# EAGLE design driverCorriente (EAGLE 6.5.0)
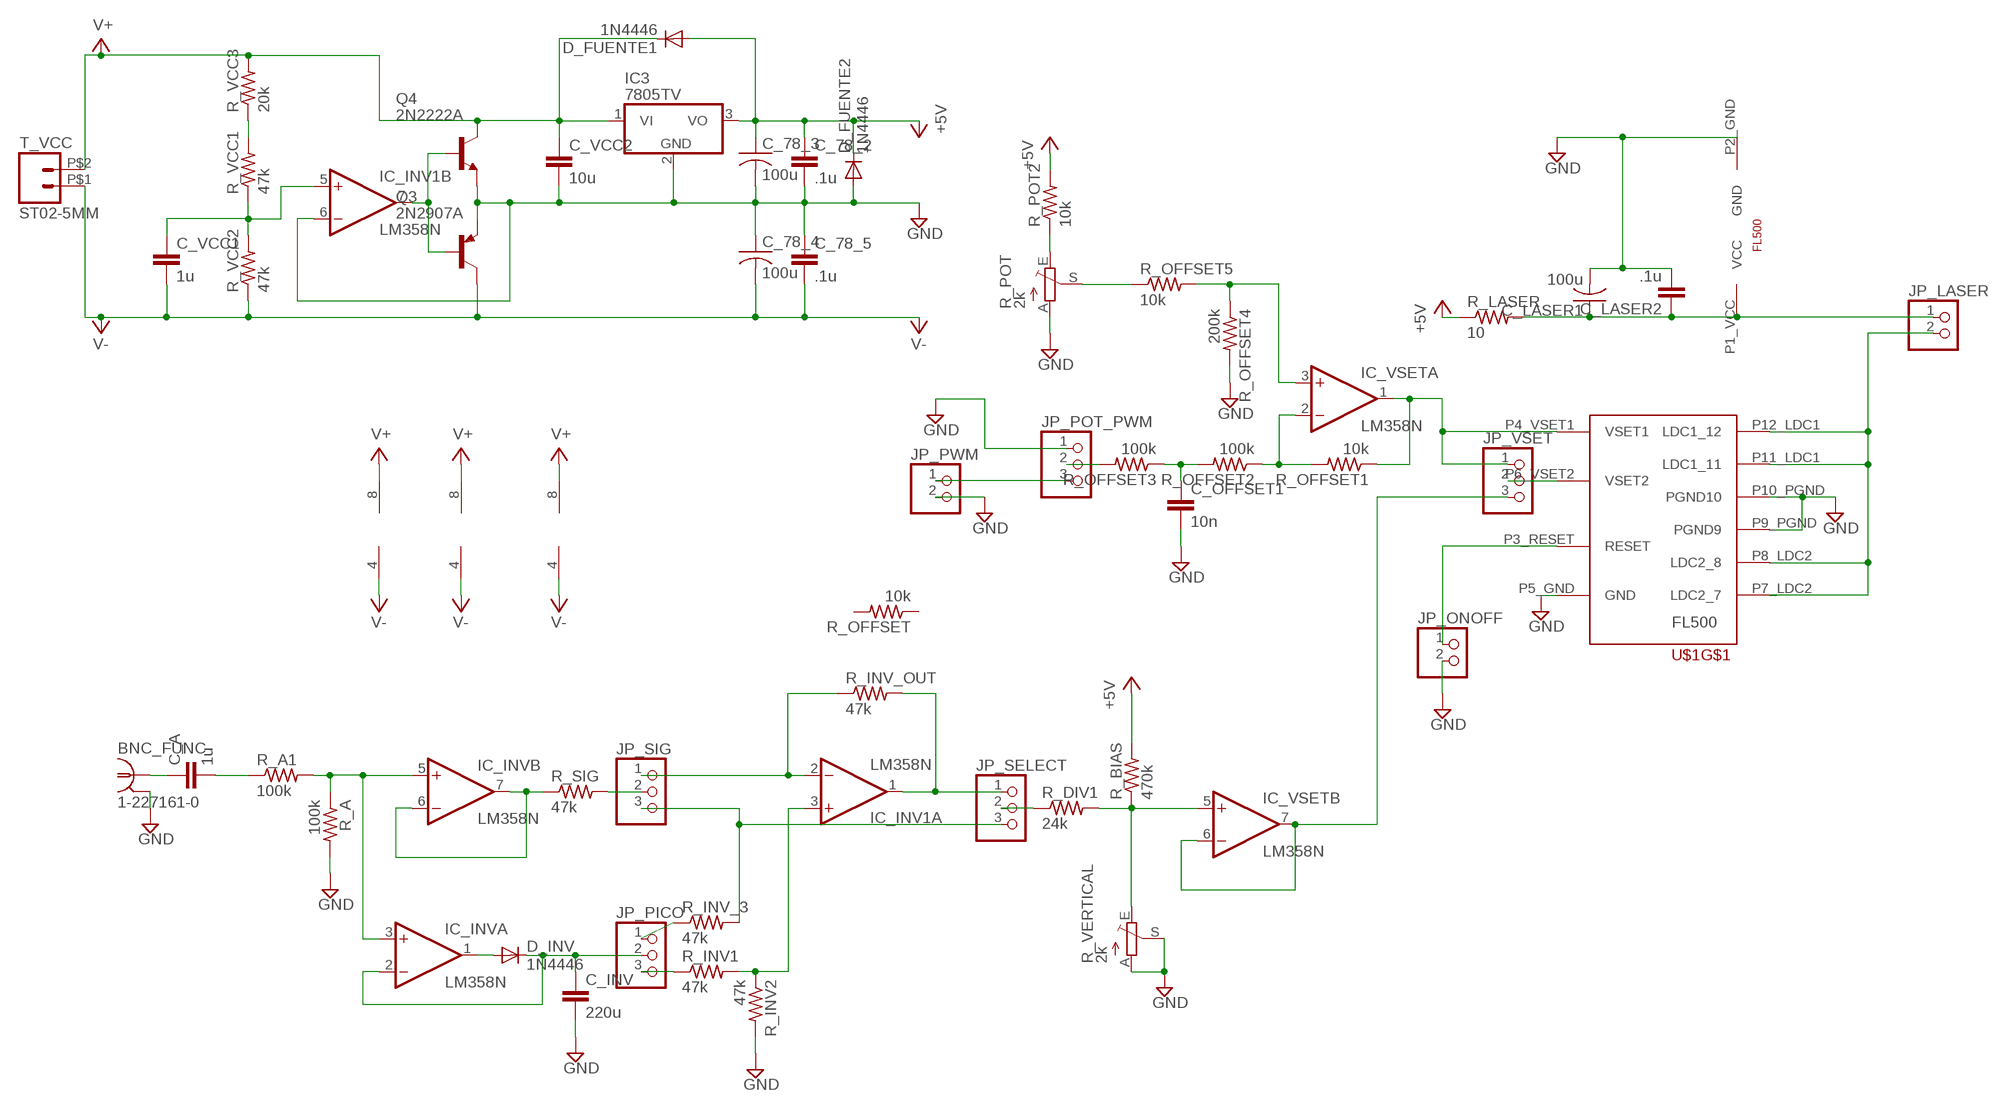
[diagram p0: schematic, sheet 1]

## Parts
BNC_FUNC  1-227161-0  [AMP_227161]
C_78_2  .1u  C-EU050-045X075  [C050-045X075]
C_78_3  100u  C-US050-075X075  [C050-075X075]
C_78_4  100u  C-US050-075X075  [C050-075X075]
C_78_5  .1u  C-EU050-045X075  [C050-045X075]
C_A  1u  C-EU050-045X075  [C050-045X075]
C_INV  220u  C-EU050-045X075  [C050-045X075]
C_LASER1  100u  C-US050-075X075  [C050-075X075]
C_LASER2  .1u  C-EU050-045X075  [C050-045X075]
C_OFFSET1  10n  C-EU050-045X075  [C050-045X075]
C_VCC1  1u  C-EU050-045X075  [C050-045X075]
C_VCC2  10u  C-EU050-045X075  [C050-045X075]
D_FUENTE1  1N4446  [DO35-10]
D_FUENTE2  1N4446  [DO35-10]
D_INV  1N4446  [DO35-10]
IC3  7805TV  [TO220V]
IC_INV  LM358N  [DIL08]
IC_INV1  LM358N  [DIL08]
IC_VSET  LM358N  [DIL08]
JP_LASER  PINHD-1X2  [1X02]
JP_ONOFF  PINHD-1X2  [1X02]
JP_PICO  PINHD-1X3  [1X03]
JP_POT_PWM  PINHD-1X3  [1X03]
JP_PWM  PINHD-1X2  [1X02]
JP_SELECT  PINHD-1X3  [1X03]
JP_SIG  PINHD-1X3  [1X03]
JP_VSET  PINHD-1X3  [1X03]
Q3  2N2907A  [TO18]
Q4  2N2222A  [TO18]
R_A  100k  R-US_0207/12  [0207/12]
R_A1  100k  R-US_0207/12  [0207/12]
R_BIAS  470k  R-US_0207/12  [0207/12]
R_DIV1  24k  R-US_0207/12  [0207/12]
R_INV1  47k  R-US_0207/12  [0207/12]
R_INV2  47k  R-US_0207/12  [0207/12]
R_INV_3  47k  R-US_0207/12  [0207/12]
R_INV_OUT  47k  R-US_0207/12  [0207/12]
R_LASER  10  R-US_0207/12  [0207/12]
R_OFFSET  10k  R-US_0207/12  [0207/12]
R_OFFSET1  10k  R-US_0207/12  [0207/12]
R_OFFSET2  100k  R-US_0207/12  [0207/12]
R_OFFSET3  100k  R-US_0207/12  [0207/12]
R_OFFSET4  200k  R-US_0207/12  [0207/12]
R_OFFSET5  10k  R-US_0207/12  [0207/12]
R_POT  2k  TRIM_EU-B64Y  [B64Y]
R_POT2  10k  R-US_0207/12  [0207/12]
R_SIG  47k  R-US_0207/12  [0207/12]
R_VCC1  47k  R-US_0207/12  [0207/12]
R_VCC2  47k  R-US_0207/12  [0207/12]
R_VCC3  20k  R-US_0207/12  [0207/12]
R_VERTICAL  2k  TRIM_EU-B64Y  [B64Y]
T_VCC  ST02-5MM  [EK500V-02P]
U$1  FL500  [FL500]

## Nets
+5V: C_78_2.1 C_78_3.1 D_FUENTE1.A D_FUENTE2.C IC3.3(VO) R_BIAS.2 R_LASER.1 R_POT2.2
GND: BNC_FUNC.2 C_78_2.2 C_78_3.2 C_78_4.1 C_78_5.1 C_INV.2 C_LASER1.2 C_LASER2.2 C_OFFSET1.2 C_VCC2.2 D_FUENTE2.A IC3.2(GND) IC_INV1.6(B:-IN) JP_ONOFF.2 JP_POT_PWM.1 JP_PWM.2 Q3.1(E) Q4.1(E) R_A.2 R_INV2.2 R_OFFSET4.2 R_POT.A R_VERTICAL.A R_VERTICAL.S U$1.P2_GND(GND) U$1.P5_GND(GND) U$1.P9_PGND(PGND9) U$1.P10_PGND(PGND10)
N$1: JP_LASER.2 U$1.P7_LDC2(LDC2_7) U$1.P8_LDC2(LDC2_8) U$1.P11_LDC1(LDC1_11) U$1.P12_LDC1(LDC1_12)
N$2: R_POT2.1 R_POT.E
N$4: IC_VSET.1(A:OUT) JP_VSET.1 R_OFFSET1.1 U$1.P4_VSET1(VSET1)
N$6: JP_ONOFF.1 U$1.P3_RESET(RESET)
N$7: IC_INV.3(A:+IN) IC_INV.5(B:+IN) R_A1.2 R_A.1
N$8: D_INV.A IC_INV.1(A:OUT)
N$9: C_INV.1 D_INV.C IC_INV.2(A:-IN) JP_PICO.2
N$10: JP_PICO.1 R_INV_3.1
N$11: JP_SIG.2 R_SIG.2
N$12: JP_SELECT.3 JP_SIG.3 R_INV_3.2
N$13: JP_PICO.3 R_INV1.1
N$14: IC_INV1.3(A:+IN) R_INV1.2 R_INV2.1
N$15: IC_INV1.2(A:-IN) JP_SIG.1 R_INV_OUT.1
N$16: IC_INV1.1(A:OUT) JP_SELECT.1 R_INV_OUT.2
N$17: JP_SELECT.2 R_DIV1.1
N$18: IC_VSET.5(B:+IN) R_BIAS.1 R_DIV1.2 R_VERTICAL.E
N$19: IC_VSET.6(B:-IN) IC_VSET.7(B:OUT) JP_VSET.3
N$20: BNC_FUNC.1 C_A.1
N$21: JP_POT_PWM.2 R_OFFSET3.2
N$23: JP_POT_PWM.3 JP_PWM.1
N$24: JP_VSET.2 U$1.P6_VSET2(VSET2)
N$25: IC_INV.6(B:-IN) IC_INV.7(B:OUT) R_SIG.1
N$26: C_A.2 R_A1.1
N$27: C_VCC1.1 IC_INV1.5(B:+IN) R_VCC1.1 R_VCC2.2
N$29: R_VCC1.2 R_VCC3.1
N$30: IC_INV1.7(B:OUT) Q3.2(B) Q4.2(B)
N$34: R_OFFSET5.1 R_POT.S
N$35: IC_VSET.2(A:-IN) R_OFFSET1.2 R_OFFSET2.1
N$36: C_OFFSET1.1 R_OFFSET2.2 R_OFFSET3.1
N$37: IC_VSET.3(A:+IN) R_OFFSET4.1 R_OFFSET5.2
V+: C_VCC2.1 D_FUENTE1.C IC3.1(VI) IC_INV1.8(P:V+) IC_INV.8(P:V+) IC_VSET.8(P:V+) Q4.3(C) R_VCC3.2 T_VCC.P$2
V-: C_78_4.2 C_78_5.2 C_VCC1.2 IC_INV1.4(P:V-) IC_INV.4(P:V-) IC_VSET.4(P:V-) Q3.3(C) R_VCC2.1 T_VCC.P$1
VCC_LASER: C_LASER1.1 C_LASER2.1 JP_LASER.1 R_LASER.2 U$1.P1_VCC(VCC)
Unconnected: R_OFFSET.1 R_OFFSET.2

## Library data of the parts
BNC_FUNC = con-coax:?227161*: JACK, RIGHT ANGLE, 50 OHM, PCB, BNC Source: amp_227161.pdf; MF: TYCO ELECTRONICS; MPN: 1-227161; OC_FARNELL: unknown; OC_NEWARK: 33B3200
C_78_2 C_78_5 C_A C_INV C_LASER2 C_OFFSET1 C_VCC1 C_VCC2 = rcl:C-EU: CAPACITOR, European symbol
C_78_3 C_78_4 C_LASER1 = rcl:C-US: CAPACITOR, American symbol
D_FUENTE1 D_FUENTE2 D_INV = diode:1N4446: DIODE high speed (Philips)
IC3 = linear:78*: Positive VOLTAGE REGULATOR Source: http://cache.national.com/ds/LM/LM78L05.pdf http://www.fairchildsemi.com/ds/LM/LM7805.pdf
IC_INV IC_INV1 IC_VSET = linear:LM358: OP AMP also LM158; LM258; LM2904 Source: http://cache.national.com/ds/LM/LM158.pdf
JP_LASER JP_ONOFF JP_PWM = pinhead:PINHD-1X2: PIN HEADER
JP_PICO JP_POT_PWM JP_SELECT JP_SIG JP_VSET = pinhead:PINHD-1X3: PIN HEADER
Q3 = transistor-pnp:2N2907*: PNP Transistor
Q4 = transistor-npn:2N2222*: NPN Transistor
R_A R_A1 R_BIAS R_DIV1 R_INV1 R_INV2 R_INV_3 R_INV_OUT R_LASER R_OFFSET R_OFFSET1-R_OFFSET5 R_POT2 R_SIG R_VCC1-R_VCC3 = rcl:R-US_: RESISTOR, American symbol
R_POT R_VERTICAL = pot:TRIM_EU-: POTENTIOMETER
T_VCC = con-dinkle:ST02: Dinkle® Screw Terminal Block - 2 Way -5MM: EK500V series. Rated at 20A, 300VAC. Cable size: 2mm² Supplier: Altronics P2034A Source: http://www.dinkle.com/upfiles/proter21253708953.pdf -5.08MM: The back half of a EK500V4R-04P. Rated at 20A, 300VAC. Cable size: 2mm² Supplier: Altronics P2024 (half of) Source: http://www.dinkle.com/upfiles/proter21253708833.pdf -3.5MM: ED350V series. Rated at 10A, 300VAC. Cable size: 1.4mm² Supplier: Altronics P2028 Source: http://www.dinkle.com/upfiles/proter21253714491.pdf
U$1 = 00_Lolo:FL500: FL500 diode laser current driver http://www.teamwavelength.com/products/product.php?part=147&view=tools#tabs

## Board
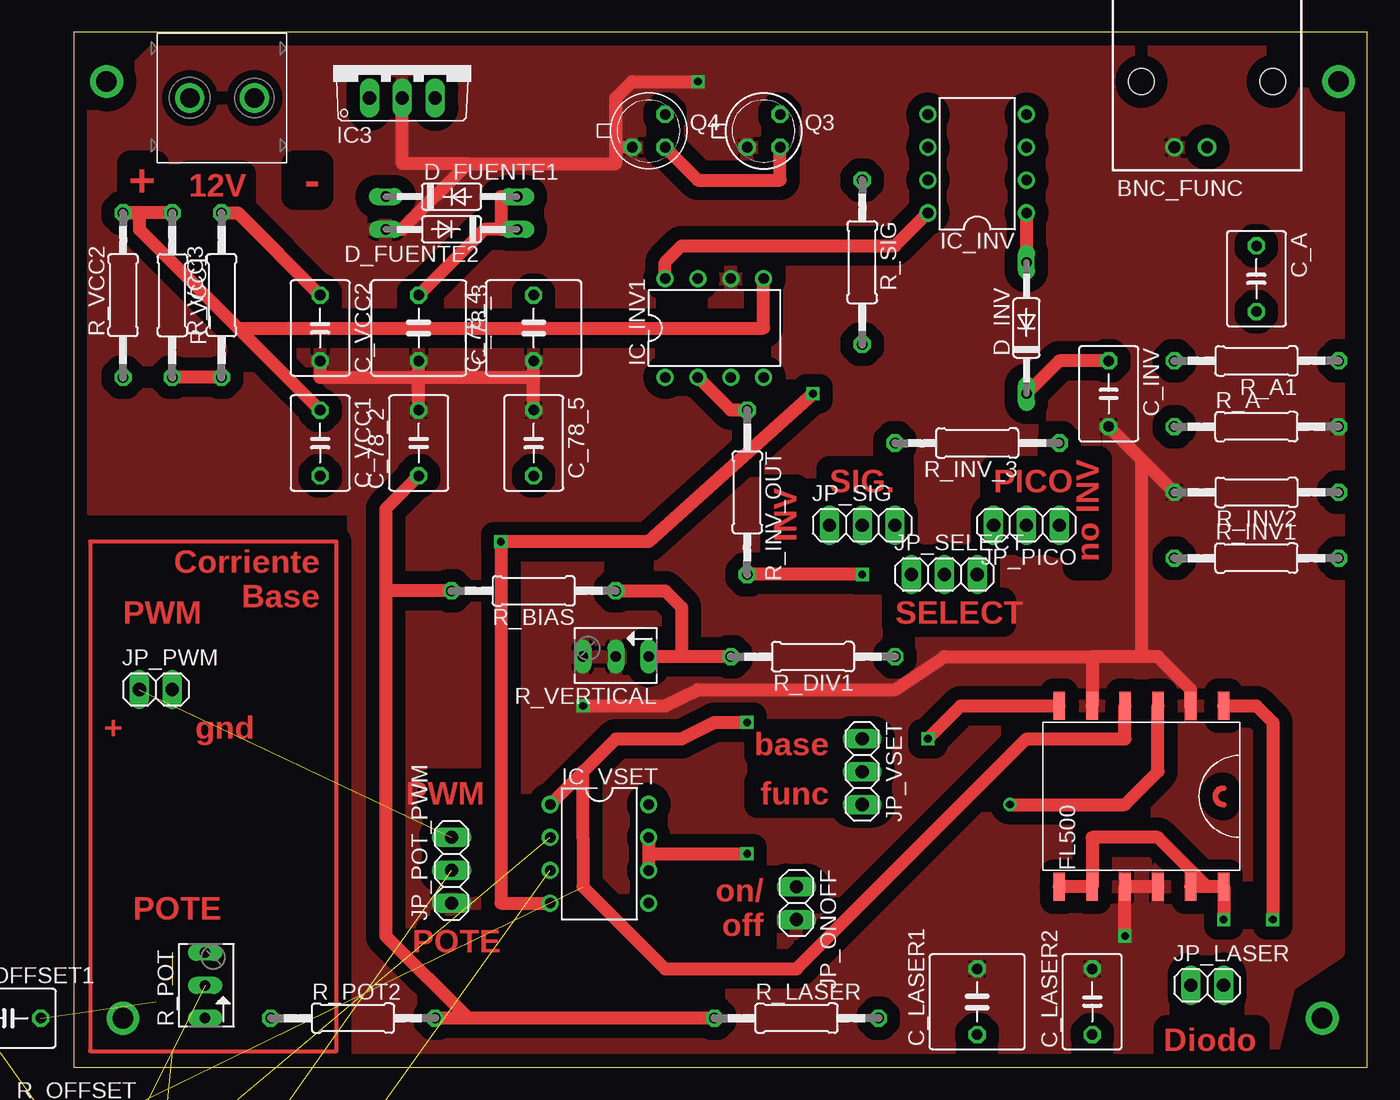
[diagram p1: board, top side]
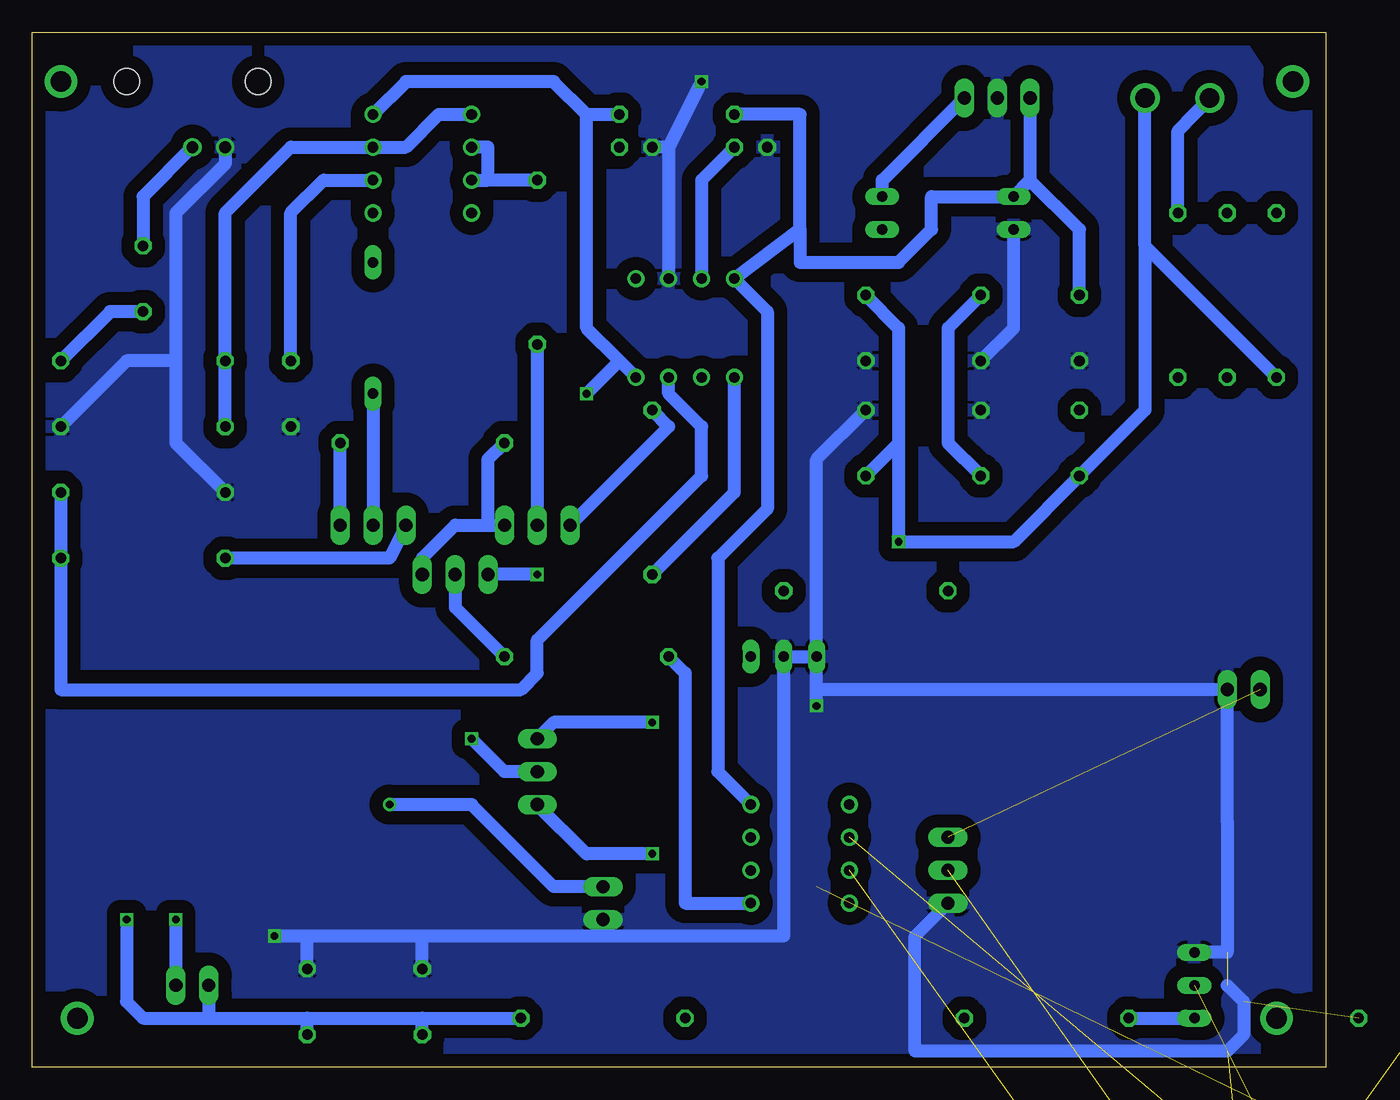
[diagram p2: board, bottom side, seen from below]

Size 100 x 80 mm. Coordinates in mm from the lower left corner, seen from the top.
Outline: 0,0 100,0 100,80 0,80 0,0
Copper layers (1*16): Top 0.035mm / dielectric 1.5mm / Bottom 0.035mm
Design rules "driverPZT_01 *": minimum track width 40mil, minimum drill 24mil, track to track 40mil, track to pad 40mil, pad to pad 40mil, via to via 40mil, smd to smd 40mil, copper to edge 40mil, drill to drill 8mil, minimum pad ring 10mil, minimum via ring 8mil, stop-mask expansion 4mil, vias tented up to drill 0mil, thermal gap 10mil

### Footprints (pad centres in the part's own frame; a part is rotated, then mirrored left to right if it is on the bottom)
AMP_227161 = drill 0.9 pad 1.27: 1 0,-5.08; 2 -2.54,-5.08 | hole 2: -5.08,0; 5.08,0
C050-045X075 = drill 0.813 octagon: 1 -2.54,0; 2 2.54,0
C050-075X075 = drill 0.813 octagon: 1 -2.54,0; 2 2.54,0
DO35-10 = drill 0.813 long: A 5.08,0; C -5.08,0
TO220V = drill 1.016 long: 1 -2.54,-2.54; 2 0,-2.54; 3 2.54,-2.54
DIL08 = drill 0.813 pad 1.27: 1 -3.81,-3.81; 2 -1.27,-3.81; 3 1.27,-3.81; 4 3.81,-3.81; 5 3.81,3.81; 6 1.27,3.81; 7 -1.27,3.81; 8 -3.81,3.81
1X02 = drill 1.016 long: 1 -1.27,0; 2 1.27,0
1X03 = drill 1.016 long: 1 -2.54,0; 2 0,0; 3 2.54,0
TO18 = drill 0.813 octagon: 1 -1.27,-1.27; 2 1.27,-1.27; 3 1.27,1.27
0207/12 = drill 0.813 octagon: 1 -6.35,0; 2 6.35,0
B64Y = drill 0.813 long: A 2.54,0; E -2.54,0; S 0,0
EK500V-02P = drill 1.5: P$1 0,0; P$2 5,0
FL500 = smd 2.159 x 0.889: P1_VCC -6.35,6.35; P2_GND -6.35,3.81; P3_RESET -6.35,1.27; P4_VSET1 -6.35,-1.27; P5_GND -6.35,-3.81; P6_VSET2 -6.35,-6.35; P7_LDC2 7.62,-6.35; P8_LDC2 7.62,-3.81; P9_PGND 7.62,-1.27; P10_PGND 7.62,1.27; P11_LDC1 7.62,3.81; P12_LDC1 7.62,6.35

### Placement (x,y rotation side)
BNC_FUNC  87.63,76.2 0 top
C_78_2  26.67,48.26 90 top
C_78_3  26.67,57.15 270 top
C_78_4  35.56,57.15 90 top
C_78_5  35.56,48.26 270 top
C_A  91.44,60.96 270 top
C_INV  80.01,52.07 270 top
C_LASER1  69.85,5.08 90 top
C_LASER2  78.74,5.08 90 top
C_OFFSET1  -5.08,3.81 0 top
C_VCC1  19.05,48.26 270 top
C_VCC2  19.05,57.15 270 top
D_FUENTE1  29.21,67.31 0 top
D_FUENTE2  29.21,64.77 180 top
D_INV  73.66,57.15 90 top
IC3  25.4,77.47 0 top
IC_INV  69.85,69.85 90 top
IC_INV1  49.53,57.15 0 top
IC_VSET  40.64,16.51 270 top
JP_LASER  87.63,6.35 0 top
JP_ONOFF  55.88,12.7 270 top
JP_PICO  73.66,41.91 180 top
JP_POT_PWM  29.21,15.24 90 top
JP_PWM  6.35,29.21 0 top
JP_SELECT  67.31,38.1 0 top
JP_SIG  60.96,41.91 0 top
JP_VSET  60.96,22.86 270 top
Q3  53.34,72.39 0 top
Q4  44.45,72.39 0 top
R_A  91.44,49.53 0 top
R_A1  91.44,54.61 180 top
R_BIAS  35.56,36.83 180 top
R_DIV1  57.15,31.75 180 top
R_INV1  91.44,39.37 0 top
R_INV2  91.44,44.45 180 top
R_INV_3  69.85,48.26 180 top
R_INV_OUT  52.07,44.45 270 top
R_LASER  55.88,3.81 0 top
R_OFFSET  -1.27,-3.81 0 top  (outside the outline)
R_OFFSET1  -1.27,-8.89 0 top  (outside the outline)
R_OFFSET2  -1.27,-13.97 0 top  (outside the outline)
R_OFFSET3  -1.27,-19.05 0 top  (outside the outline)
R_OFFSET4  -1.27,-24.13 0 top  (outside the outline)
R_OFFSET5  -1.27,-29.21 0 top  (outside the outline)
R_POT  10.16,6.35 90 top
R_POT2  21.59,3.81 0 top
R_SIG  60.96,62.23 270 top
R_VCC1  7.62,59.69 270 top
R_VCC2  3.81,59.69 90 top
R_VCC3  11.43,59.69 90 top
R_VERTICAL  41.91,31.75 180 top
T_VCC  13.97,74.93 180 top
U$1  82.55,21.59 270 top

### Tracks (layer width: path | path; a pad name or v marks a point on that pad's centre or on a via)
+5V
  Top 1.016: R_LASER.1 R_POT2.2 30.48,3.81 24.13,10.16 24.13,36.83 | D_FUENTE1.A 33.02,67.31 33.02,64.77 D_FUENTE2.C 31.75,64.77 C_78_3.1 | C_78_2.1 24.13,43.18 24.13,36.83 | R_BIAS.2 24.13,36.83
  Bottom 1.016: C_78_2.1 29.21,48.26 29.21,57.15 C_78_3.1 | IC3.3 34.29,68.58 D_FUENTE1.A
GND  (via drill 0.6)  (3 unrouted)
  Top 1.016: 78.74,31.75 U$1.P5_GND | 82.55,31.75 83.82,31.75 86.36,29.21 U$1.P2_GND | 82.55,31.75 78.74,31.75 | C_INV.2 82.55,46.99 | 82.55,46.99 R_INV2.2 | 82.55,46.99 82.55,31.75 | 41.91,71.12 41.91,69.85 30.48,69.85 | 30.48,69.85 25.4,64.77 D_FUENTE2.A | IC3.2 25.4,69.85 30.48,69.85 | U$1.P10_PGND U$1.P9_PGND v81.28,10.16 | 78.74,31.75 67.31,31.75 63.5,29.21 48.26,29.21 45.72,27.94 v39.37,27.94 | Q4.1 41.91,71.12 | 41.91,71.12 41.91,74.93 43.18,76.2 v48.26,76.2 | C_VCC2.2 19.05,53.34 26.67,53.34 | 26.67,53.34 C_78_3.2 | C_78_2.2 26.67,53.34 | 26.67,53.34 35.56,53.34 | C_78_5.1 35.56,53.34 | 35.56,53.34 C_78_4.1
  Bottom 1.016: 50.8,71.12 IC_INV1.6 | D_FUENTE2.A 24.13,57.15 C_78_3.2 | R_POT.A 7.62,8.89 7.62,19.05 JP_PWM.2 39.37,29.21 | 55.88,10.16 41.91,10.16 R_VERTICAL.S R_VERTICAL.A | C_78_5.1 39.37,46.99 R_VERTICAL.A | v48.26,76.2 50.8,71.12 | 50.8,71.12 Q3.1 | 55.88,10.16 JP_ONOFF.2 | BNC_FUNC.2 85.09,69.85 88.9,66.04 88.9,54.61 | 88.9,54.61 92.71,54.61 R_A.2 | 88.9,54.61 88.9,48.26 R_INV2.2 | 55.88,10.16 69.85,10.16 | C_LASER1.2 69.85,10.16 | 69.85,10.16 78.74,10.16 | C_LASER2.2 78.74,10.16 | 78.74,10.16 v81.28,10.16 | v39.37,27.94 39.37,29.21 | 39.37,29.21 R_VERTICAL.A | 7.62,6.35 6.35,5.08 6.35,2.54 7.62,1.27 31.75,1.27 31.75,10.16 JP_POT_PWM.1
  pour Top: 1.27,73.66 1.27,43.18 21.59,43.18 21.59,1.27 92.71,1.27 93.98,6.35 97.79,8.89 97.79,73.66 95.25,74.93 93.98,78.74 6.35,78.74
  pour Bottom: 6.35,78.74 3.81,74.93 1.27,74.93 1.27,6.35 6.35,5.08 5.08,0 93.98,0 95.25,6.35 99.06,6.35 99.06,73.66 95.25,76.2 95.25,78.74
N$1  (via drill 0.6)
  Top 1.016: U$1.P7_LDC2 U$1.P8_LDC2 78.74,17.78 83.82,17.78 87.63,13.97 | 87.63,13.97 U$1.P12_LDC1 v88.9,11.43 | 87.63,13.97 U$1.P11_LDC1
  Bottom 1.016: v88.9,11.43 JP_LASER.2
N$2
  Bottom 1.016: R_POT2.1 R_POT.E
N$4  (via drill 0.6)  (1 unrouted)
  Top 1.016: U$1.P4_VSET1 81.28,25.4 73.66,25.4 55.88,7.62 45.72,7.62 39.37,13.97 39.37,17.78 39.37,22.86 IC_VSET.1 41.91,25.4 46.99,25.4 49.53,26.67 v52.07,26.67
  Bottom 1.016: v52.07,26.67 59.69,26.67 JP_VSET.1
N$5  (via drill 1.6 pad 2.54)
  other vias: 2.54,76.2
N$6  (via drill 0.61)
  Top 1.016: v72.39,20.32 81.28,20.32 83.82,22.86 U$1.P3_RESET
  Bottom 1.016: v72.39,20.32 66.04,20.32 59.69,13.97 JP_ONOFF.1
N$7
  Bottom 1.016: R_A.1 R_A1.2 85.09,66.04 80.01,71.12 IC_INV.3 71.12,71.12 68.58,73.66 IC_INV.5
N$8
  Top 1.016: IC_INV.1 D_INV.A
N$9
  Top 1.016: D_INV.C 76.2,54.61 C_INV.1
  Bottom 1.016: IC_INV.2 77.47,68.58 80.01,66.04 C_INV.1 | D_INV.C JP_PICO.2
N$10
  Bottom 1.016: JP_PICO.1 R_INV_3.1
N$11
  Bottom 1.016: R_SIG.2 JP_SIG.2
N$12
  Bottom 1.016: JP_SELECT.3 69.85,39.37 67.31,41.91 64.77,41.91 | 64.77,41.91 64.77,46.99 R_INV_3.2 | 64.77,41.91 JP_SIG.3
N$13
  Bottom 1.016: R_INV1.1 72.39,39.37 JP_PICO.3
N$14
  Bottom 1.016: R_INV2.1 R_INV1.2 97.79,29.21 62.23,29.21 60.96,30.48 60.96,33.02 48.26,45.72 48.26,49.53 50.8,52.07 IC_INV1.3
N$15
  Top 1.016: R_INV_OUT.1 50.8,50.8 IC_INV1.2
  Bottom 1.016: JP_SIG.1 50.8,49.53 R_INV_OUT.1
N$16  (via drill 0.6)
  Top 1.016: v60.96,38.1 R_INV_OUT.2
  Bottom 1.016: IC_INV1.1 45.72,44.45 R_INV_OUT.2 | v60.96,38.1 JP_SELECT.1
N$17
  Bottom 1.016: R_DIV1.1 67.31,35.56 JP_SELECT.2
N$18
  Top 1.016: R_DIV1.2 46.99,31.75 | 46.99,31.75 R_VERTICAL.E | R_BIAS.1 45.72,36.83 46.99,35.56 46.99,31.75
  Bottom 1.016: IC_VSET.5 49.53,12.7 49.53,30.48 R_DIV1.2
N$19  (via drill 0.6)
  Top 1.016: IC_VSET.6 IC_VSET.7 44.45,16.51 v52.07,16.51
  Bottom 1.016: v52.07,16.51 57.15,16.51 JP_VSET.3
N$20
  Bottom 1.016: BNC_FUNC.1 91.44,67.31 C_A.1
N$21  (1 unrouted)
N$23  (1 unrouted)
N$24  (via drill 0.6)
  Top 1.016: v66.04,25.4 68.58,27.94 U$1.P6_VSET2
  Bottom 1.016: JP_VSET.2 63.5,22.86 v66.04,25.4
N$25
  Bottom 1.016: R_SIG.1 64.77,68.58 | IC_INV.7 64.77,68.58 | 64.77,68.58 64.77,71.12 IC_INV.6
N$26
  Bottom 1.016: C_A.2 93.98,58.42 R_A1.1
N$27
  Top 1.016: R_VCC1.1 R_VCC2.2 5.08,66.04 5.08,64.77 12.7,57.15 | 12.7,57.15 C_VCC1.1 | IC_INV1.5 53.34,57.15 12.7,57.15
N$28  (via drill 1.6 pad 2.54)
  other vias: 3.81,3.81
N$29
  Top 1.016: R_VCC3.1 R_VCC1.2
N$30
  Top 1.016: Q3.2 54.61,68.58 48.26,68.58 Q4.2
  Bottom 1.016: IC_INV1.7 48.26,68.58 Q4.2
N$31  (via drill 1.6 pad 2.54)
  other vias: 96.52,3.81
N$32  (via drill 1.6 pad 2.54)
  other vias: 97.79,76.2
N$33
  Top 0.305: 1.27,40.64 1.27,1.27 20.32,1.27 20.32,40.64 1.27,40.64
N$34  (1 unrouted)
N$35  (2 unrouted)
N$36  (2 unrouted)
N$37  (2 unrouted)
V+
  Top 1.016: C_VCC2.1 12.7,66.04 R_VCC3.2 | IC_INV.8 63.5,63.5 46.99,63.5 45.72,62.23 IC_INV1.8
  Bottom 1.016: 22.86,68.58 D_FUENTE1.C 30.48,67.31 30.48,64.77 33.02,62.23 40.64,62.23 40.64,64.77 | IC3.1 22.86,68.58 | R_VCC3.2 11.43,72.39 T_VCC.P$2 | 22.86,68.58 19.05,64.77 C_VCC2.1 | IC_VSET.8 46.99,22.86 46.99,39.37 43.18,43.18 43.18,58.42 IC_INV1.8 40.64,64.77 | 40.64,64.77 40.64,73.66 Q4.3
V-  (via drill 0.6)
  Top 1.016: v57.15,52.07 44.45,40.64 v33.02,40.64 33.02,12.7 IC_VSET.4
  Bottom 1.016: 13.97,63.5 T_VCC.P$1 | R_VCC2.1 13.97,63.5 | 13.97,63.5 13.97,50.8 C_VCC1.2 24.13,40.64 v33.02,40.64 33.02,48.26 | 33.02,48.26 33.02,57.15 C_78_4.2 | 57.15,73.66 Q3.3 | 57.15,73.66 57.15,57.15 54.61,54.61 | IC_INV1.4 54.61,54.61 | 54.61,54.61 v57.15,52.07 | 57.15,73.66 59.69,76.2 71.12,76.2 IC_INV.4 | C_78_5.2 33.02,48.26
VCC_LASER  (via drill 0.6)
  Top 1.016: U$1.P1_VCC 91.44,27.94 92.71,26.67 v92.71,11.43
  Bottom 1.016: v92.71,11.43 92.71,5.08 91.44,3.81 86.36,3.81 | 86.36,3.81 78.74,3.81 | 78.74,3.81 69.85,3.81 | 69.85,3.81 R_LASER.2 | JP_LASER.1 86.36,3.81 | C_LASER2.1 78.74,3.81 | C_LASER1.1 69.85,3.81

### Text on the board
Top: + | 12V | - | no INV | SIG. | PICO | INV | Corriente / Base | PWM | SELECT | + | gnd | base | PWM | func | POTE | on/ / off | POTE | Diodo